# EAGLE design button debounce pos (EAGLE 9.4.2)
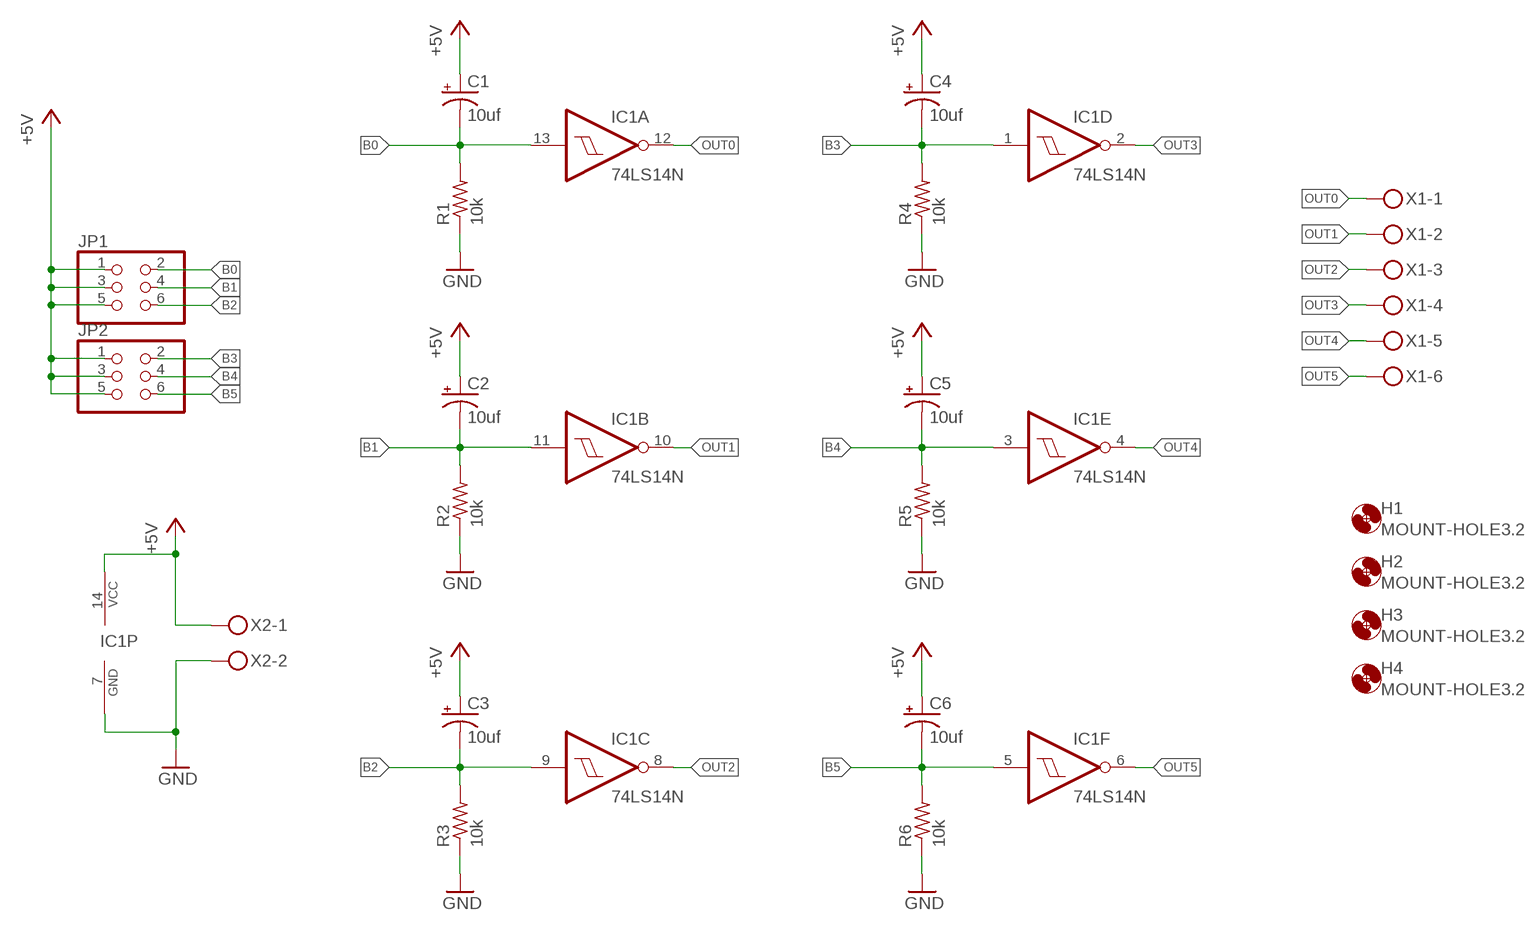
[diagram p0: schematic, sheet 1]

## Parts
C1  10uf  CPOL-USE2-5  [E2-5]
C2  10uf  CPOL-USE2-5  [E2-5]
C3  10uf  CPOL-USE2-5  [E2-5]
C4  10uf  CPOL-USE2-5  [E2-5]
C5  10uf  CPOL-USE2-5  [E2-5]
C6  10uf  CPOL-USE2-5  [E2-5]
H1  MOUNT-HOLE3.2  [3,2]
H2  MOUNT-HOLE3.2  [3,2]
H3  MOUNT-HOLE3.2  [3,2]
H4  MOUNT-HOLE3.2  [3,2]
IC1  74LS14N  [DIL14]
JP1  PINHD-2X3  [2X03]
JP2  PINHD-2X3  [2X03]
R1  10k  R-US_0207/2V  [0207/2V]
R2  10k  R-US_0207/2V  [0207/2V]
R3  10k  R-US_0207/2V  [0207/2V]
R4  10k  R-US_0207/2V  [0207/2V]
R5  10k  R-US_0207/2V  [0207/2V]
R6  10k  R-US_0207/2V  [0207/2V]
X1  MKDSN1,5/6-5,08  [MKDSN1,5/6-5,08]
X2  MKDSN1,5/2-5,08  [MKDSN1,5/2-5,08]

## Nets
+5V: C1.+ C2.+ C3.+ C4.+ C5.+ C6.+ IC1.14(P:VCC) JP1.1 JP1.3 JP1.5 JP2.1 JP2.3 JP2.5 X2.1
B0: C1.- IC1.13(A:I) JP1.2 R1.2
B1: C2.- IC1.11(B:I) JP1.4 R2.2
B2: C3.- IC1.9(C:I) JP1.6 R3.2
B3: C4.- IC1.1(D:I) JP2.2 R4.2
B4: C5.- IC1.3(E:I) JP2.4 R5.2
B5: C6.- IC1.5(F:I) JP2.6 R6.2
GND: IC1.7(P:GND) R1.1 R2.1 R3.1 R4.1 R5.1 R6.1 X2.2
OUT0: IC1.12(A:O) X1.1
OUT1: IC1.10(B:O) X1.2
OUT2: IC1.8(C:O) X1.3
OUT3: IC1.2(D:O) X1.4
OUT4: IC1.4(E:O) X1.5
OUT5: IC1.6(F:O) X1.6

## Library data of the parts
C1-C6 = resistor:CPOL-US: POLARIZED CAPACITOR, American symbol
H1-H4 = holes:MOUNT-HOLE: MOUNTING HOLE with drill center marker
IC1 = 74xx-us:74*14: Hex schmitt trigger INVERTER
JP1 JP2 = pinhead:PINHD-2X3: PIN HEADER
R1-R6 = resistor:R-US_: RESISTOR, American symbol
X1 = con-phoenix-508:MKDSN1,5/6-5,08: MKDSN 1,5/ 6-5,08 Printklemme Nennstrom: 13,5 A Nennspannung: 250 V Rastermaß: 5,08 mm Polzahl: 6 Anschlussart: Schraubanschluss Montage: Löten Anschlussrichtung Leiter/Platine: 0 ° Artikelnummer: 1729160 Source: http://eshop.phoenixcontact.com .. 1729160.pdf
X2 = con-phoenix-508:MKDSN1,5/2-5,08: MKDSN 1,5/ 2-5,08 Printklemme Nennstrom: 13,5 A Nennspannung: 250 V Rastermaß: 5,08 mm Polzahl: 2 Anschlussart: Schraubanschluss Montage: Löten Anschlussrichtung Leiter/Platine: 0 ° Artikelnummer: 1729128 Source: http://eshop.phoenixcontact.com .. 1729128.pdf

## Board
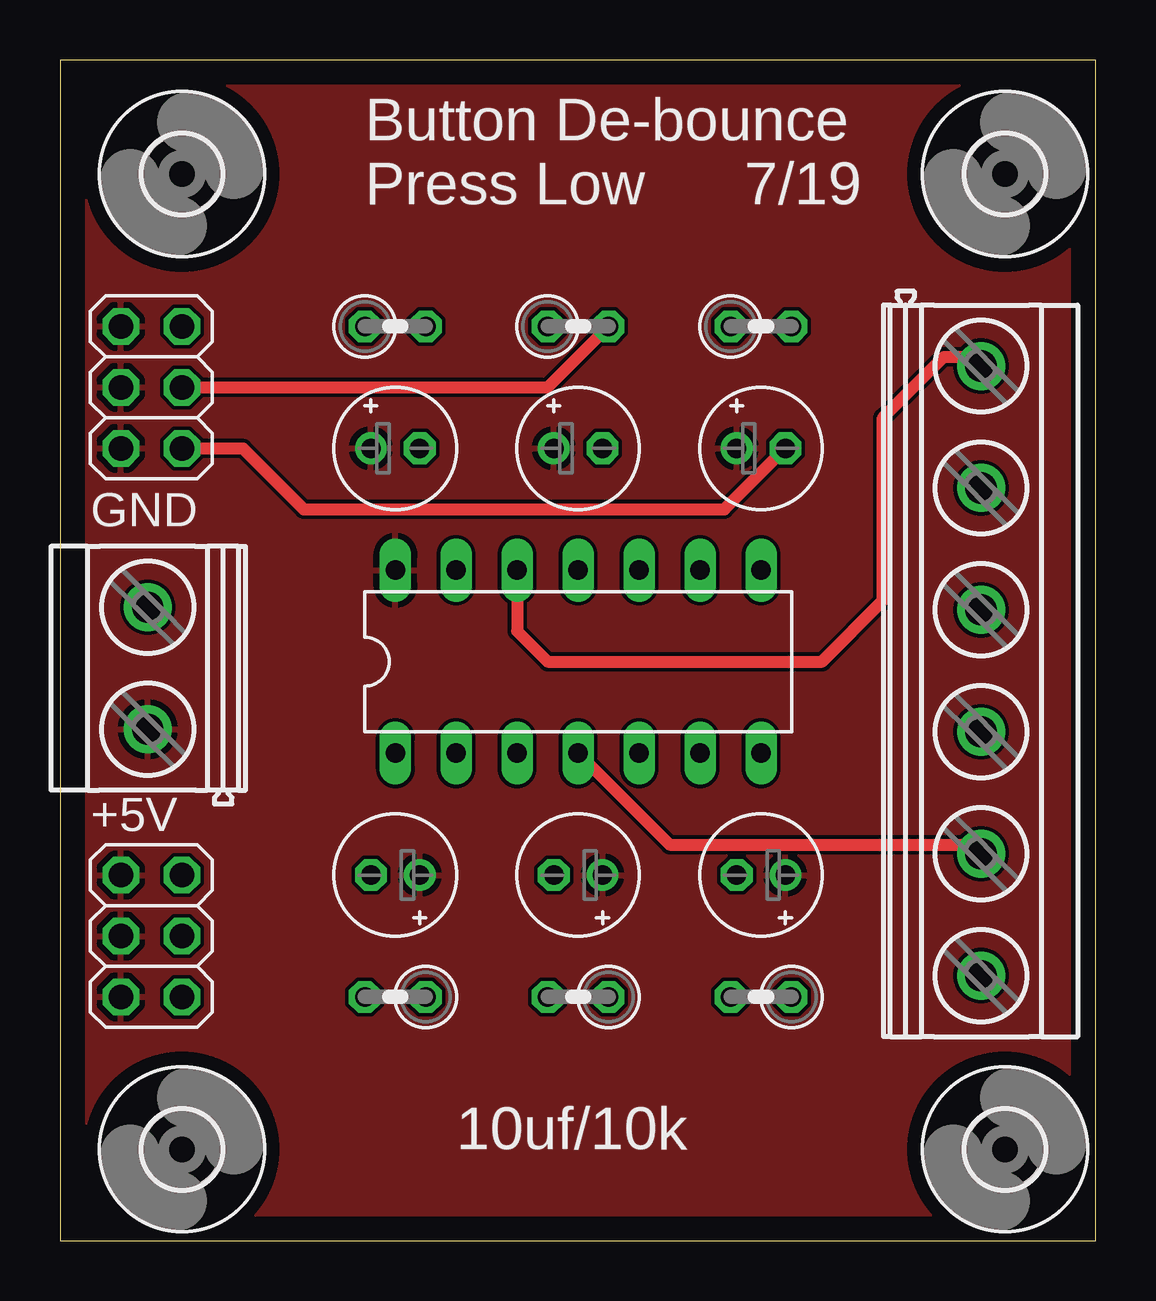
[diagram p1: board, top side]
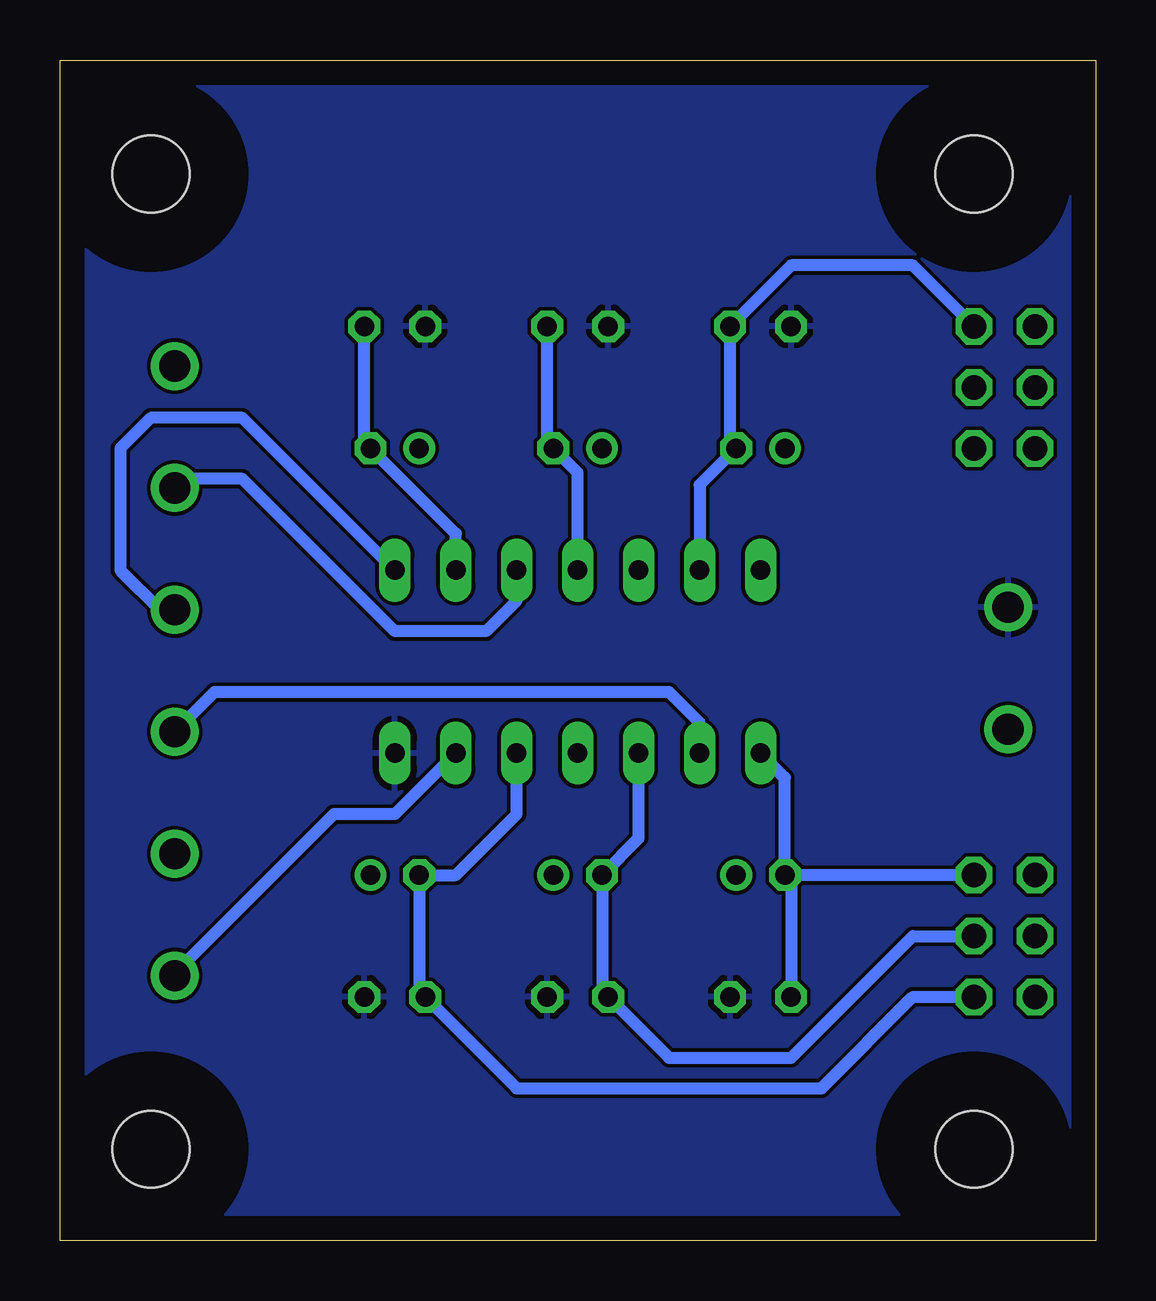
[diagram p2: board, bottom side, seen from below]

Size 43.16 x 49.2 mm. Coordinates in mm from the lower left corner, seen from the top.
Outline: 0,0 43.16,0 43.16,49.2 0,49.2 0,0
Copper layers (1*16): Top 0.035mm / dielectric 1.5mm / Bottom 0.035mm
Design rules "default": minimum track width 6mil, minimum drill 0.35mm, track to track 6mil, track to pad 6mil, pad to pad 6mil, via to via 6mil, smd to smd 6mil, copper to edge 40mil, drill to drill 6mil, minimum pad ring 10mil, minimum via ring 8mil, stop-mask expansion 4mil, vias tented up to drill 0mil, thermal gap 10mil

### Footprints (pad centres in the part's own frame; a part is rotated, then mirrored left to right if it is on the bottom)
E2-5 = drill 0.813 pad 1.27: + -1.016,0 | drill 0.813 pad 1.27 octagon: - 1.016,0
3,2 = hole 3.2: 0,0
DIL14 = drill 0.813 long: 1 -7.62,-3.81; 2 -5.08,-3.81; 3 -2.54,-3.81; 4 0,-3.81; 5 2.54,-3.81; 6 5.08,-3.81; 7 7.62,-3.81; 8 7.62,3.81; 9 5.08,3.81; 10 2.54,3.81; 11 0,3.81; 12 -2.54,3.81; 13 -5.08,3.81; 14 -7.62,3.81
2X03 = drill 1.016 octagon: 1 -2.54,-1.27; 2 -2.54,1.27; 3 0,-1.27; 4 0,1.27; 5 2.54,-1.27; 6 2.54,1.27
0207/2V = drill 0.813 octagon: 1 -1.27,0; 2 1.27,0
MKDSN1,5/6-5,08 = drill 1.3 pad 2: 1 -12.7,0.025; 2 -7.62,0.025; 3 -2.54,0.025; 4 2.54,0.025; 5 7.62,0.025; 6 12.7,0.025
MKDSN1,5/2-5,08 = drill 1.3 pad 2: 1 -2.561,0.025; 2 2.519,0.025

### Placement (x,y rotation side)
C1  13.97,33.02 0 top
C2  21.59,33.02 0 top
C3  29.21,33.02 0 top
C4  13.97,15.24 180 top
C5  21.59,15.24 180 top
C6  29.21,15.24 180 top
H1  5.08,44.45 0 top
H2  39.37,44.45 0 top
H3  5.08,3.81 0 top
H4  39.37,3.81 0 top
IC1  21.59,24.13 0 top
JP1  3.81,35.56 270 top
JP2  3.81,12.7 270 top
R1  13.97,38.1 0 top
R2  21.59,38.1 0 top
R3  29.21,38.1 0 top
R4  13.97,10.16 180 top
R5  21.59,10.16 180 top
R6  29.21,10.16 180 top
X1  38.35,23.75 270 top
X2  3.68,23.88 90 top

### Tracks (layer width: path | path; a pad name or v marks a point on that pad's centre or on a via)
+5V
  pour Top: -1.27,54.61 72.39,54.61 72.39,-2.54 -1.27,-2.54
B0
  Bottom 0.508: JP1.2 7.62,40.64 12.7,40.64 R1.2 15.24,33.27 C1.- 16.51,31.5 IC1.13
B1
  Top 0.508: JP1.4 20.32,35.56 R2.2
  Bottom 0.508: R2.2 22.86,33.27 C2.- 21.59,32 IC1.11
B2
  Top 0.508: JP1.6 7.62,33.02 10.16,30.48 27.69,30.48 C3.-
  Bottom 0.508: R3.2 30.48,33.27 C3.- 26.67,29.46 IC1.9
B3
  Bottom 0.508: C4.- 12.7,14.99 R4.2 | C4.- 12.95,19.3 IC1.1 | JP2.2 C4.-
B4
  Bottom 0.508: IC1.3 19.05,16.76 C5.- 20.57,10.41 R5.2 17.78,7.62 12.7,7.62 7.62,12.7 JP2.4
B5
  Bottom 0.508: IC1.5 24.13,17.78 26.67,15.24 C6.- 28.19,10.41 R6.2 24.13,6.35 11.43,6.35 7.62,10.16 JP2.6
GND
  pour Bottom: -1.27,55.88 74.93,55.88 74.93,-1.27 -1.27,-1.27
OUT0
  Top 0.508: X1.1 38,36.83 36.83,36.83 34.29,34.29 34.29,26.67 31.75,24.13 20.32,24.13 19.05,25.4 IC1.12
OUT1
  Bottom 0.508: IC1.10 24.13,26.67 25.4,25.4 29.21,25.4 35.56,31.75 38,31.75 X1.2
OUT2
  Bottom 0.508: IC1.8 35.56,34.29 39.37,34.29 40.64,33.02 40.64,27.94 38.99,26.29 X1.3
OUT3
  Bottom 0.508: IC1.2 16.51,21.59 17.78,22.86 36.73,22.86 X1.4
OUT4
  Top 0.508: IC1.4 25.4,16.51 38,16.51 X1.5
OUT5
  Bottom 0.508: IC1.6 29.21,17.78 31.75,17.78 38.38,11.15 X1.6

### Text on the board
tNames: Button De-bounce / Press Low 7/19 | GND | +5V | 10uf/10k